# Altium project gydrodrive_control_board.PrjPcb (part 2 of 2)

## Sheet gydrodrive_currentSource.SchDoc
size 297 x 209 mm; SheetNumber: 8; SheetTotal: 22
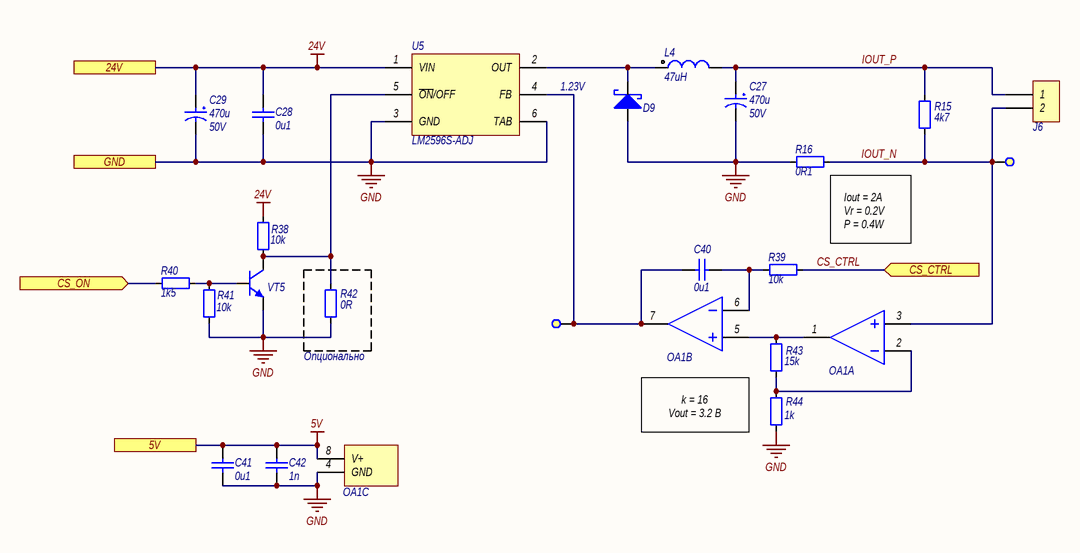
[diagram p11: gydrodrive_currentSource.SchDoc]

### Parts
C27  Capacitance: 470u  Voltage: 50V  [ECAP1020]  (hidden comment: JRB1H471M05001000200000B)
C28  Capacitance: 0u1  [CAPC2012-0805M]  (hidden comment: CAP_0805)
C29  Capacitance: 470u  Voltage: 50V  [ECAP1020]  (hidden comment: JRB1H471M05001000200000B)
C40  Capacitance: 0u1  [CAPC2012-0805M]  (hidden comment: CAP_0805)
C41  Capacitance: 0u1  [CAPC2012-0805M]  (hidden comment: CAP_0805)
C42  Capacitance: 1n  [CAPC2012-0805M]  (hidden comment: CAP_0805)
D9  SK56  [SMB_M]  (value not drawn)
J6  DG142V-5.08-02P  [DG142V-5.08-02P]  (value not drawn)
L4  Inductance: 47uH  [IND_IHL4040_M]  (hidden comment: IHLP4040DZER470M11)
OA1  LMV358IDR  [SO8_M]  (value not drawn)  (parts A,B,C of 3)
R15  Resistance: 4k7  [RESC3216-1206M]  (hidden comment: RES_1206)
R16  Resistance: 0R1  [RESC6332-2512M]  (hidden comment: RES_2512)
R38  Resistance: 10k  [RESC2012-0805M]  (hidden comment: RES_0805)
R39  Resistance: 10k  [RESC2012-0805M]  (hidden comment: RES_0805)
R40  Resistance: 1k5  [RESC2012-0805M]  (hidden comment: RES_0805)
R41  Resistance: 10k  [RESC2012-0805M]  (hidden comment: RES_0805)
R42  Resistance: 0R  [RESC2012-0805M]  (hidden comment: RES_0805)
R43  Resistance: 15k  [RESC2012-0805M]  (hidden comment: RES_0805)
R44  Resistance: 1k  [RESC2012-0805M]  (hidden comment: RES_0805)
TP6  Test point 1  [TP_1]  (value not drawn)  (no BOM)
TP7  Test point 1  [TP_1]  (value not drawn)  (no BOM)
U5  LM2596S-ADJ  [TO-263-5M]
VT5  BC817  [SOT23-3M]  (value not drawn)

### Ports
5V (see gydrodrive_main[1B], gydrodrive_can[4B], gydrodrive_discreteControl[3B], gydrodrive_interfaces[3C], gydrodrive_supply[5A]), 24V (see gydrodrive_main[1B], gydrodrive_button[4B], gydrodrive_control[4B], gydrodrive_discreteControl[4B], gydrodrive_encoder[5B], gydrodrive_linearPosSensor[3B], gydrodrive_sensor[3B], gydrodrive_sensors[2B], gydrodrive_sto[4B], gydrodrive_supply[2B]), CS_CTRL (in, see gydrodrive_main[2B], gydrodrive_mcu[3A]), CS_ON (in, see gydrodrive_main[2B], gydrodrive_mcu[3C]), GND (see gydrodrive_main[1B], gydrodrive_button[3C], gydrodrive_can[3C], gydrodrive_control[3B], gydrodrive_debugger[4C], gydrodrive_discreteControl[3B], gydrodrive_encoder[2A], gydrodrive_i2c[5C], gydrodrive_indication[4C], gydrodrive_inputTrim[4C], gydrodrive_interfaces[3A], gydrodrive_linearPosSensor[2C], gydrodrive_mcu[6D], gydrodrive_reservedPins[4B], gydrodrive_rs485[3B], gydrodrive_sensor[3C], gydrodrive_sensors[2B], gydrodrive_sto[3C], gydrodrive_supply[2C], gydrodrive_uart[4C])

### Nets
5V: C41.2 C42.2 OA1.8(V+) ; port 5V
24V: C28.1 C29.1 R38.2 U5.1(VIN) ; port 24V
GND: C27.2 C28.2 C29.2 C41.1 C42.1 D9.2(A) OA1.4(GND) R16.1 R41.1 R42.1 R44.1 U5.3(GND) U5.6(TAB) VT5.2(E) ; port GND
CS_CTRL: R39.1 ; port CS_CTRL
CS_ON: R40.2 ; port CS_ON
IOUT_N: J6.2 OA1.3(INA+) R15.1 R16.2 TP6.1
IOUT_P: C27.1 J6.1 L4.2 R15.2
NetC40_1: C40.1 OA1.6(INB-) R39.2
NetC40_2: C40.2 OA1.7(OUTB) TP7.1 U5.4(FB)
NetD9_1: D9.1(K) L4.1 U5.2(OUT)
NetOA1_1: OA1.1(OUTA) OA1.5(INB+) R43.2
NetOA1_2: OA1.2(INA-) R43.1 R44.2
NetR38_1: R38.1 R42.2 U5.5(~{ON}/OFF) VT5.3(C)
NetR40_1: R40.1 R41.2 VT5.1(B)

### Notes on the sheet
- 1.23V
- (near R16) Iout = 2A
  Vr = 0.2V
  P = 0.4W
- (near R42) Опционально
- k = 16
  Vout = 3.2 В
- Подп. и дата
- Инв. № дубл.
- Взам. инв. №
- Инв. № подл.
- Изм.
- Лист
- № докум.
- Подп.
- Дата
- Копировал
- Формат
- A4

### Library data of the parts
C27 C29 = JRB1H471M05001000200000B: Конденсатор электролитический; Part Name: Конд-р электрол.  JRB1H471M05001000200000B, 470uF, 50V; Parameters: 470uF, 50V; Max Price: 30; Part Number: JRB1H471M05001000200000B; Component Type: Standart
C28 C40 C41 = CAPC_0805: as C1 on sheet gydrodrive_mcu; Part Number: CAPC_0805; Part Name: ='Конд-р керам. 0805,  '  + Parameters; Component Type: Standart; Pin Count: 2
C42 = CAPC_0805: Конденсатор керамический, корпус 0805; Parameters: 1n,  50V; Voltage: 50V; Max Price: 5; Part Number: CAPC_0805; Part Name: ='Конд-р керам. 0805,  '  + Parameters; Component Type: Standart; Pin Count: 2
D9 = SK56: Диод Шоттки; Part Name: Диод Шоттки SK56; Parameters: 60V, 5A; Voltage: 60V; Current: 5A; Max Price: 50; Part Number: SK56; Component Type: Standart; Pin Count: 2
J6 = DG142V-5.08-02P: as J1 on sheet gydrodrive_supply; Part Number: DG142V-5.08-02P; Component Type: Standart; Pin Count: 2
L4 = IHLP4040DZER470M11: Индуктивность силовая; Part Name: Индуктивность IHLP4040DZER470M11; Current: 3A; Max Price: 100; Part Number: IHLP4040DZER470M11; Component Type: Standart; Pin Count: 2; Parameters: 47uH
OA1 = LMV358IDR: Операционный усилитель RTR, маломощный, 2 канала; Part Name: Операционный усилитель LMV358IDR; Supply Current: 210uA; Supply Voltage: 2.7..5.5V; Max Price: 40; Offset Voltage: 1700uV; Bias Current: 15nA; RTR: IO; Part Number: LMV358IDR; Component Type: Standart; Pin Count: 8
R15 = RESC_1206: Рез-р, корпус 1206; Tolerance: 5%; Parameters: 4k7, 5%; Max Price: 12; Part Number: RESC_1206; Part Name: ='Рез-р 1206, ' + Parameters; Component Type: Standart
R16 = RESC_2512: Рез-р, корпус 2512; Tolerance: 5%; Parameters: 0R1, 5%; Max Price: 20; Part Number: RESC_2512; Part Name: ='Рез-р 2512, ' + Parameters; Component Type: Standart
R38 R39 R41 = RESC_0805: as R45 on sheet gydrodrive_mcu; Part Number: RESC_0805; Part Name: ='Рез-р 0805, ' + Parameters; Component Type: Standart
R40 = RESC_0805: Рез-р, корпус 0805; Tolerance: 5%; Parameters: 1k5, 5%; Max Price: 3; Part Number: RESC_0805; Part Name: ='Рез-р 0805, ' + Parameters; Component Type: Standart
R42 = RESC_0805: Рез-р, корпус 0805; Tolerance: 5%; Parameters: 0R, 5%; Max Price: 3; Part Number: RESC_0805; Part Name: ='Рез-р 0805, ' + Parameters; Component Type: Standart
R43 = RESC_0805: Рез-р, корпус 0805; Tolerance: 5%; Parameters: 15k, 5%; Max Price: 3; Part Number: RESC_0805; Part Name: ='Рез-р 0805, ' + Parameters; Component Type: Standart
R44 = RESC_0805: Рез-р, корпус 0805; Tolerance: 5%; Parameters: 1k, 5%; Max Price: 3; Part Number: RESC_0805; Part Name: ='Рез-р 0805, ' + Parameters; Component Type: Standart
TP6 TP7 = Test point 1: Тестовый контакт круглый 1 мм; Part Number: Test point 1; Part Name: Тестовый контакт; Component Type: Standart (No BOM)
U5 = LM2596S-ADJ: DC-DC преобразователь; Part Name: DC-DC преобразователь LM2596S-ADJ; Parameters: 40V, 1.23..37V, 3A, 150kHz; Max Price: 600; ComponentLink1Description: LM2596 Datasheet; ComponentLink1URL: http://www.national.com/ds/LM/LM2596.pdf; ComponentLink3Description: TS5B Package Page; ComponentLink3URL: http://www.national.com/packaging/folders/ts5b.html; Part Number: LM2596S-ADJ; Component Type: Standart; HelpURL: https://www.ti.com/lit/ds/symlink/lm2596.pdf
VT5 = BC817: Биполярный транзистор; Part Name: Транзистор BC817; Parameters: 45V, 0.5A; Voltage: 45V; Current: 500 mA; Max Price: 20; Part Number: BC817; Component Type: Standart

## Sheet gydrodrive_interfaces.SchDoc
size 297 x 209 mm; SheetNumber: 13; SheetTotal: 22
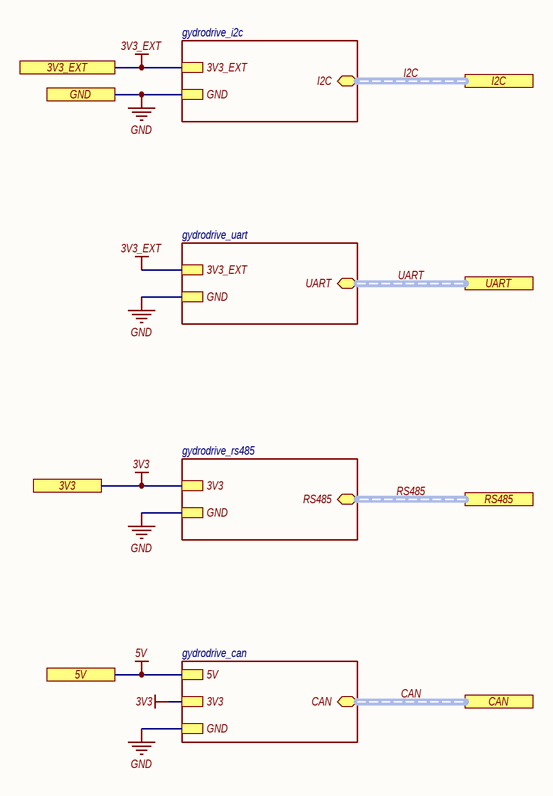
[diagram p12: gydrodrive_interfaces.SchDoc]

### Sub-sheets
C = gydrodrive_can: CAN (bidir, harness CAN), GND, 5V, 3V3
I = gydrodrive_i2c: I2C (bidir, harness I2C), 3V3_EXT, GND
R = gydrodrive_rs485: RS485 (bidir, harness RS485), GND, 3V3
U = gydrodrive_uart: UART (bidir, harness UART), GND, 3V3_EXT

### Ports
3V3 (see gydrodrive_main[1A], gydrodrive_button[3B], gydrodrive_can[3B], gydrodrive_debugger[3B], gydrodrive_encoder[2A], gydrodrive_indication[4C], gydrodrive_inputTrim[4B], gydrodrive_mcu[4C], gydrodrive_rs485[4B], gydrodrive_sto[3B], gydrodrive_supply[5B]), 3V3_EXT (see gydrodrive_main[1A], gydrodrive_i2c[5B], gydrodrive_reservedPins[4B], gydrodrive_supply[5B], gydrodrive_uart[4B]), 5V (see gydrodrive_main[1A], gydrodrive_can[4B], gydrodrive_currentSource[2C], gydrodrive_discreteControl[3B], gydrodrive_supply[5A]), CAN (harness CAN, see gydrodrive_main[2A], gydrodrive_can[1C], gydrodrive_mcu[1C]), GND (see gydrodrive_main[1A], gydrodrive_button[3C], gydrodrive_can[3C], gydrodrive_control[3B], gydrodrive_currentSource[2B], gydrodrive_debugger[4C], gydrodrive_discreteControl[3B], gydrodrive_encoder[2A], gydrodrive_i2c[5C], gydrodrive_indication[4C], gydrodrive_inputTrim[4C], gydrodrive_linearPosSensor[2C], gydrodrive_mcu[6D], gydrodrive_reservedPins[4B], gydrodrive_rs485[3B], gydrodrive_sensor[3C], gydrodrive_sensors[2B], gydrodrive_sto[3C], gydrodrive_supply[2C], gydrodrive_uart[4C]), I2C (harness I2C, see gydrodrive_main[2A], gydrodrive_i2c[1C], gydrodrive_mcu[1B]), RS485 (harness RS485, see gydrodrive_main[2A], gydrodrive_mcu[1C], gydrodrive_rs485[1B]), UART (harness UART, see gydrodrive_main[2A], gydrodrive_mcu[1B], gydrodrive_uart[3B])

### Nets
3V3: port 3V3, sheet R/3V3, sheet C/3V3
3V3_EXT: port 3V3_EXT, sheet I/3V3_EXT, sheet U/3V3_EXT
5V: port 5V, sheet C/5V
GND: port GND, sheet I/GND, sheet U/GND, sheet R/GND, sheet C/GND

### Buses and harness runs
harness CAN = port CAN = sheet C/CAN
harness I2C = port I2C = sheet I/I2C
harness RS485 = port RS485 = sheet R/RS485
harness UART = port UART = sheet U/UART

### Notes on the sheet
- Подп. и дата
- Инв. № дубл.
- Взам. инв. №
- Инв. № подл.
- Изм.
- Лист
- № докум.
- Подп.
- Дата
- Копировал
- Формат
- A4

## Sheet gydrodrive_i2c.SchDoc
size 297 x 209 mm; SheetNumber: 17; SheetTotal: 22
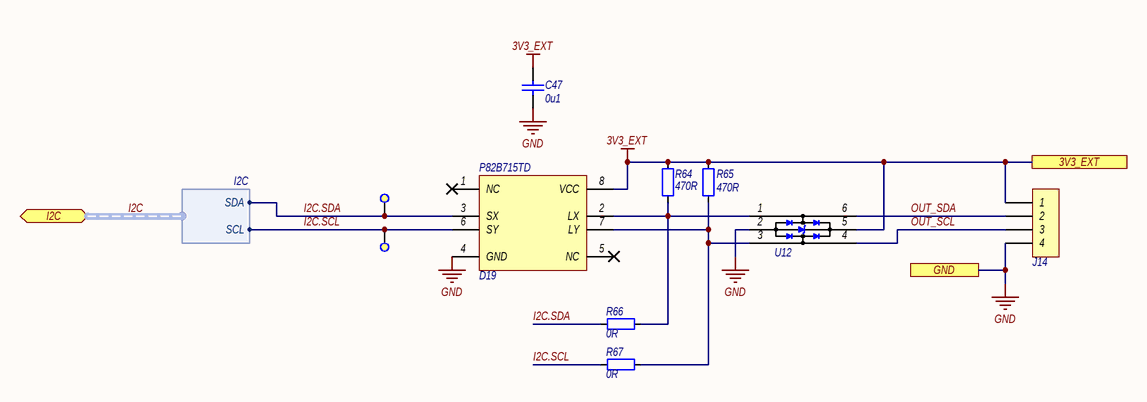
[diagram p13: gydrodrive_i2c.SchDoc]

### Parts
C47  Capacitance: 0u1  [CAPC2012-0805M]  (hidden comment: CAP_0805)
D19  P82B715TD  [SO8_M]
J14  DG142V-5.08-04P  [DG142V-5.08-04P]  (value not drawn)
R64  Resistance: 470R  [RESC2012-0805M]  (hidden comment: RES_0805)
R65  Resistance: 470R  [RESC2012-0805M]  (hidden comment: RES_0805)
R66  Resistance: 0R  [RESC2012-0805M]  (hidden comment: RES_0805)
R67  Resistance: 0R  [RESC2012-0805M]  (hidden comment: RES_0805)
TP16  Test point 1  [TP_1]  (value not drawn)  (no BOM)
TP17  Test point 1  [TP_1]  (value not drawn)  (no BOM)
U12  USBLC6-2SC6  [SOT23-6AM]  (value not drawn)

### Ports
3V3_EXT (see gydrodrive_interfaces[3A], gydrodrive_reservedPins[2B], gydrodrive_supply[3B], gydrodrive_uart[2B]), GND (see gydrodrive_interfaces[3A], gydrodrive_button[2C], gydrodrive_can[2C], gydrodrive_control[2C], gydrodrive_currentSource[1B], gydrodrive_debugger[3C], gydrodrive_discreteControl[2B], gydrodrive_encoder[1B], gydrodrive_indication[3C], gydrodrive_inputTrim[2C], gydrodrive_interfaces[3A], gydrodrive_linearPosSensor[2C], gydrodrive_mcu[6D], gydrodrive_reservedPins[2C], gydrodrive_rs485[2B], gydrodrive_sensor[2C], gydrodrive_sensors[1B], gydrodrive_sto[2C], gydrodrive_supply[2C], gydrodrive_uart[2C]), I2C (bidir, harness I2C, see gydrodrive_interfaces[4A], gydrodrive_mcu[1B])

### Harnesses
I2C: SDA, SCL

### Nets
3V3_EXT: C47.1 D19.8(VCC) J14.1 R64.2 R65.2 U12.5(Vbus) ; port 3V3_EXT
GND: C47.2 D19.4(GND) J14.4 U12.2(GND) ; port GND
I2C.SCL: D19.6(SY) R67.1 TP17.1 ; port I2C.SCL
I2C.SDA: D19.3(SX) R66.1 TP16.1 ; port I2C.SDA
OUT_SCL: J14.3 U12.4(IO2)
OUT_SDA: J14.2 U12.6(IO1)
NetD19_2: D19.2(LX) R64.1 R66.2 U12.1(IO1)
NetD19_7: D19.7(LY) R65.1 R67.2 U12.3(IO2)

Not connected (* = marked no-connect by the designer): D19 1(NC)* 5(NC)*

### Buses and harness runs
harness I2C = port I2C

### Notes on the sheet
- Подп. и дата
- Инв. № дубл.
- Взам. инв. №
- Инв. № подл.
- Изм.
- Лист
- № докум.
- Подп.
- Дата
- Копировал
- Формат
- A4

### Library data of the parts
C47 = CAPC_0805: as C1 on sheet gydrodrive_mcu; Part Number: CAPC_0805; Part Name: ='Конд-р керам. 0805,  '  + Parameters; Component Type: Standart; Pin Count: 2
D19 = P82B715TD: Расширитель порта I2C; Part Name: Микросхема P82B715TD; Max Price: 300; Part Number: P82B715TD; Component Type: Standart; Parameters: I2C
J14 = DG142V-5.08-04P: Клеммник 4-контактный, шаг 5.08 мм; Part Name: Клеммник DG142V-5.08-04P; Parameters: 8А; Max Price: 60; System: Connector; Part Number: DG142V-5.08-04P; Component Type: Standart; Pin Count: 4
R64 R65 = RESC_0805: Рез-р, корпус 0805; Tolerance: 5%; Parameters: 470R, 5%; Max Price: 3; Part Number: RESC_0805; Part Name: ='Рез-р 0805, ' + Parameters; Component Type: Standart
R66 R67 = RESC_0805: as R42 on sheet gydrodrive_currentSource; Part Number: RESC_0805; Part Name: ='Рез-р 0805, ' + Parameters; Component Type: Standart
TP16 TP17 = Test point 1: Тестовый контакт круглый 1 мм; Part Number: Test point 1; Part Name: Тестовый контакт; Component Type: Standart (No BOM)
U12 = USBLC6-2SC6: Диодная сборка для защиты дифференциальной линии; Part Name: Диодная сборка USBLC6-2SC6; Parameters: 5.25V; Max Price: 30; Part Number: USBLC6-2SC6; Component Type: Standart; Pin Count: 6; Voltage: 5.25V

## Sheet gydrodrive_uart.SchDoc
size 297 x 209 mm; SheetNumber: 15; SheetTotal: 22
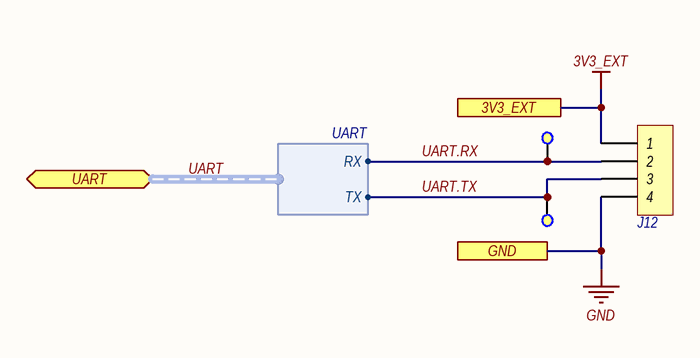
[diagram p14: gydrodrive_uart.SchDoc]

### Parts
J12  DG142V-5.08-04P  [DG142V-5.08-04P]  (value not drawn)
TP12  Test point 1  [TP_1]  (value not drawn)  (no BOM)
TP13  Test point 1  [TP_1]  (value not drawn)  (no BOM)

### Ports
3V3_EXT (see gydrodrive_interfaces[3B], gydrodrive_i2c[5B], gydrodrive_interfaces[3A], gydrodrive_reservedPins[2B], gydrodrive_supply[3B]), GND (see gydrodrive_interfaces[3B], gydrodrive_button[2C], gydrodrive_can[2C], gydrodrive_control[2C], gydrodrive_currentSource[1B], gydrodrive_debugger[3C], gydrodrive_discreteControl[2B], gydrodrive_encoder[1B], gydrodrive_i2c[5C], gydrodrive_indication[3C], gydrodrive_inputTrim[2C], gydrodrive_interfaces[3A], gydrodrive_linearPosSensor[2C], gydrodrive_mcu[6D], gydrodrive_reservedPins[2C], gydrodrive_rs485[2B], gydrodrive_sensor[2C], gydrodrive_sensors[1B], gydrodrive_sto[2C], gydrodrive_supply[2C]), UART (bidir, harness UART, see gydrodrive_interfaces[4B], gydrodrive_mcu[1B])

### Harnesses
UART: RX, TX

### Nets
3V3_EXT: J12.1 ; port 3V3_EXT
GND: J12.4 ; port GND
UART.RX: J12.2 TP12.1 ; port UART.RX
UART.TX: J12.3 TP13.1 ; port UART.TX

### Buses and harness runs
harness UART = port UART

### Notes on the sheet
- Подп. и дата
- Инв. № дубл.
- Взам. инв. №
- Инв. № подл.
- Изм.
- Лист
- № докум.
- Подп.
- Дата
- Копировал
- Формат
- A4

### Library data of the parts
J12 = DG142V-5.08-04P: as J14 on sheet gydrodrive_i2c; Part Number: DG142V-5.08-04P; Component Type: Standart; Pin Count: 4
TP12 TP13 = Test point 1: Тестовый контакт круглый 1 мм; Part Number: Test point 1; Part Name: Тестовый контакт; Component Type: Standart (No BOM)

## Sheet gydrodrive_rs485.SchDoc
size 297 x 209 mm; SheetNumber: 14; SheetTotal: 22
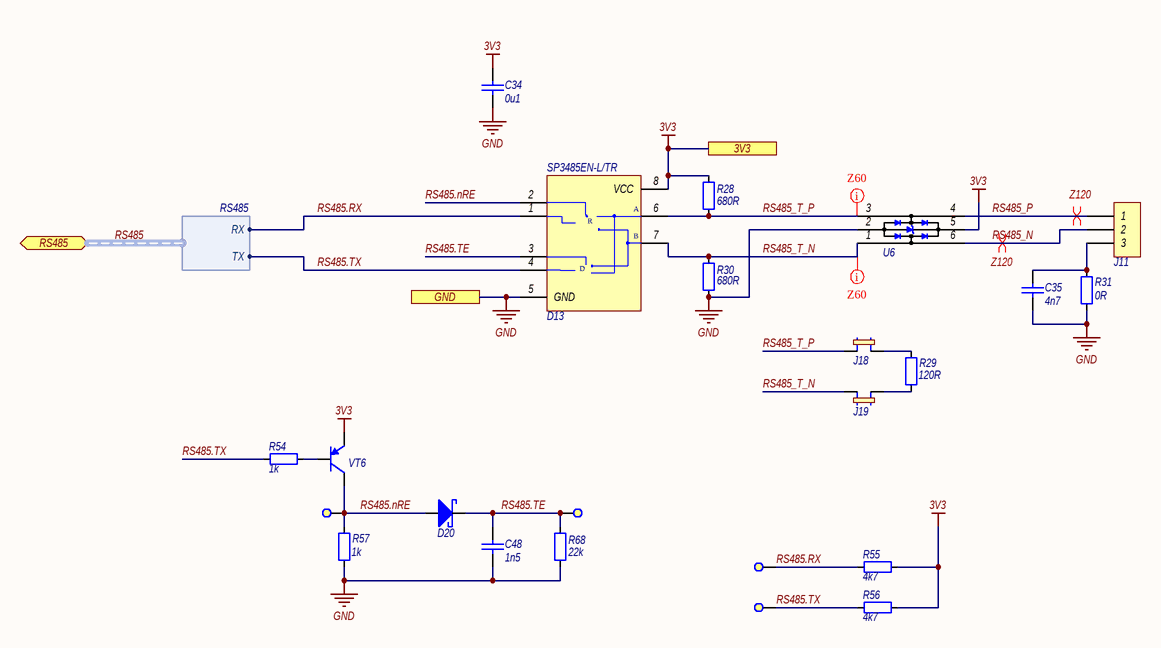
[diagram p15: gydrodrive_rs485.SchDoc]

### Parts
C34  Capacitance: 0u1  [CAPC2012-0805M]  (hidden comment: CAP_0805)
C35  Capacitance: 4n7  [CAPC3216-1206M]  (hidden comment: CAP_1206)
C48  Capacitance: 1n5  [CAPC2012-0805M]  (hidden comment: CAP_0805)
D13  SP3485EN-L/TR  [SO8_M]
D20  MBR0540  [SOD_123_M]  (value not drawn)
J11  DG142V-5.08-03P  [DG142V-5.08-03P]  (value not drawn)
J18  PLS-2.54-2 JUMP  [PLS-2-2.54]  (value not drawn)
J19  PLS-2.54-2 JUMP  [PLS-2-2.54]  (value not drawn)
R28  Resistance: 680R  [RESC3216-1206M]  (hidden comment: RES_1206)
R29  Resistance: 120R  [RESC3216-1206M]  (hidden comment: RES_1206)
R30  Resistance: 680R  [RESC3216-1206M]  (hidden comment: RES_1206)
R31  Resistance: 0R  [RESC3216-1206M]  (hidden comment: RES_1206)
R54  Resistance: 1k  [RESC2012-0805M]  (hidden comment: RES_0805)
R55  Resistance: 4k7  [RESC2012-0805M]  (hidden comment: RES_0805)
R56  Resistance: 4k7  [RESC2012-0805M]  (hidden comment: RES_0805)
R57  Resistance: 1k  [RESC2012-0805M]  (hidden comment: RES_0805)
R68  Resistance: 22k  [RESC2012-0805M]  (hidden comment: RES_0805)
TP1  Test point 1  [TP_1]  (value not drawn)  (no BOM)
TP10  Test point 1  [TP_1]  (value not drawn)  (no BOM)
TP11  Test point 1  [TP_1]  (value not drawn)  (no BOM)
TP19  Test point 1  [TP_1]  (value not drawn)  (no BOM)
U6  USBLC6-2SC6  [SOT23-6AM]  (value not drawn)
VT6  BC807  [SOT23-3M]  (value not drawn)

### Ports
3V3 (see gydrodrive_interfaces[3C], gydrodrive_button[2B], gydrodrive_can[2B], gydrodrive_debugger[2B], gydrodrive_encoder[1A], gydrodrive_indication[3C], gydrodrive_inputTrim[2B], gydrodrive_interfaces[3C], gydrodrive_mcu[4C], gydrodrive_sto[2B], gydrodrive_supply[3C]), GND (see gydrodrive_interfaces[3C], gydrodrive_button[2C], gydrodrive_can[2C], gydrodrive_control[2C], gydrodrive_currentSource[1B], gydrodrive_debugger[3C], gydrodrive_discreteControl[2B], gydrodrive_encoder[1B], gydrodrive_i2c[5C], gydrodrive_indication[3C], gydrodrive_inputTrim[2C], gydrodrive_interfaces[3A], gydrodrive_linearPosSensor[2C], gydrodrive_mcu[6D], gydrodrive_reservedPins[2C], gydrodrive_sensor[2C], gydrodrive_sensors[1B], gydrodrive_sto[2C], gydrodrive_supply[2C], gydrodrive_uart[4C]), RS485 (bidir, harness RS485, see gydrodrive_interfaces[4C], gydrodrive_mcu[1C])

### Harnesses
RS485: RX, TX

### Nets
3V3: C34.2 D13.8(VCC) R28.2 R55.1 R56.1 U6.5(Vbus) VT6.2(E) ; port 3V3
GND: C34.1 C35.1 C48.1 D13.5(GND) R30.1 R31.2 R57.1 R68.1 U6.2(GND) ; port GND
RS485.nRE: D13.2(~{RE}) D20.2(A) R57.2 TP19.1 VT6.3(C)
RS485.RX: D13.1(RO) R55.2 TP10.1 ; port RS485.RX
RS485.TE: C48.2 D13.3(DE) D20.1(K) R68.2 TP11.1
RS485.TX: D13.4(DI) R54.2 R56.2 TP1.1 ; port RS485.TX
RS485_N: J11.2 U6.6(IO1)
RS485_P: J11.1 U6.4(IO2)
RS485_T_N: D13.7(B) J19.2 R30.2 U6.1(IO1)
RS485_T_P: D13.6(A) J18.2 R28.1 U6.3(IO2)
NetC35_2: C35.2 J11.3 R31.1
NetJ18_1: J18.1 R29.2
NetJ19_1: J19.1 R29.1
NetR54_1: R54.1 VT6.1(B)

### Buses and harness runs
harness RS485 = port RS485

### Layout directives
differential pair; differential pair class Z120: RS485_N, RS485_P
net class Z60: RS485_T_N, RS485_T_P

### Notes on the sheet
- Подп. и дата
- Инв. № дубл.
- Взам. инв. №
- Инв. № подл.
- Изм.
- Лист
- № докум.
- Подп.
- Дата
- Копировал
- Формат
- A4
- (in symbol SP3485EN-L/TR) R; D

### Library data of the parts
C34 = CAPC_0805: Конденсатор керамический, корпус 0805; Parameters: 0u1,  50V; Voltage: 50V; Max Price: 5; Part Number: CAPC_0805; Part Name: ='Конд-р керам. 0805,  '  + Parameters; Component Type: Standart; Pin Count: 2
C35 = CAPC_1206: Конденсатор керамический, корпус 1206; Parameters: 4n7,  50V; Voltage: 50V; Max Price: 12; Part Number: CAPC_1206; Part Name: ='Конд-р керам. 1206,  '  + Parameters; Component Type: Standart; Pin Count: 2
C48 = CAPC_0805: Конденсатор керамический, корпус 0805; Parameters: 1n5,  50V; Voltage: 50V; Max Price: 5; Part Number: CAPC_0805; Part Name: ='Конд-р керам. 0805,  '  + Parameters; Component Type: Standart; Pin Count: 2
D13 = SP3485EN-L/TR: Дифференциальный приемопередатчик rs485; Part Name: Микросхема SP3485EN-L/TR; Parameters: 3V3; Max Price: 50; Part Number: SP3485EN-L/TR; Component Type: Standart
D20 = MBR0540: Диод Шоттки; Part Name: Диод Шоттки MBR0540; Parameters: 40V, 0.5A; Voltage: 40V; Current: 500mA; Max Price: 10; Part Number: MBR0540; Component Type: Standart; Pin Count: 2
J11 = DG142V-5.08-03P: Клеммник 3-контактный, шаг 5.08 мм; Part Name: Клеммник DG142V-5.08-03P; Parameters: 8А; Max Price: 60; System: Connector; Part Number: DG142V-5.08-03P; Component Type: Standart; Pin Count: 3
J18 J19 = PLS-2.54-2 JUMP: Разъем штыревой шаг 2.54 мм; Part Name: Разъем PLS-2, шаг 2.54 мм; Parameters: 2.54 мм; Max Price: 10; System: Connector; Part Number: PLS-2.54-2 JUMP; Component Type: Standart; Pin Count: 2
R28 R30 = RESC_1206: Рез-р, корпус 1206; Tolerance: 5%; Parameters: 680R, 5%; Max Price: 12; Part Number: RESC_1206; Part Name: ='Рез-р 1206, ' + Parameters; Component Type: Standart
R29 = RESC_1206: Рез-р, корпус 1206; Tolerance: 5%; Parameters: 120R, 5%; Max Price: 12; Part Number: RESC_1206; Part Name: ='Рез-р 1206, ' + Parameters; Component Type: Standart
R31 = RESC_1206: Рез-р, корпус 1206; Tolerance: 5%; Parameters: 0R, 5%; Max Price: 12; Part Number: RESC_1206; Part Name: ='Рез-р 1206, ' + Parameters; Component Type: Standart
R54 R57 = RESC_0805: Рез-р, корпус 0805; Tolerance: 5%; Parameters: 1k, 5%; Max Price: 3; Part Number: RESC_0805; Part Name: ='Рез-р 0805, ' + Parameters; Component Type: Standart
R55 R56 = RESC_0805: Рез-р, корпус 0805; Tolerance: 5%; Parameters: 4k7, 5%; Max Price: 3; Part Number: RESC_0805; Part Name: ='Рез-р 0805, ' + Parameters; Component Type: Standart
R68 = RESC_0805: Рез-р, корпус 0805; Tolerance: 5%; Parameters: 22k, 5%; Max Price: 3; Part Number: RESC_0805; Part Name: ='Рез-р 0805, ' + Parameters; Component Type: Standart
TP1 TP10 TP11 TP19 = Test point 1: Тестовый контакт круглый 1 мм; Part Number: Test point 1; Part Name: Тестовый контакт; Component Type: Standart (No BOM)
U6 = USBLC6-2SC6: Диодная сборка для защиты дифференциальной линии; Part Name: Диодная сборка USBLC6-2SC6; Parameters: 5.25V; Max Price: 30; Part Number: USBLC6-2SC6; Component Type: Standart; Pin Count: 6; Voltage: 5.25V
VT6 = BC807: Биполярный транзистор; Part Name: Транзистор BC807; Parameters: 45V, 0.5A; Voltage: 45V; Current: 500 mA; Max Price: 20; Part Number: BC807; Component Type: Standart

## Sheet gydrodrive_can.SchDoc
size 297 x 209 mm; SheetNumber: 16; SheetTotal: 22
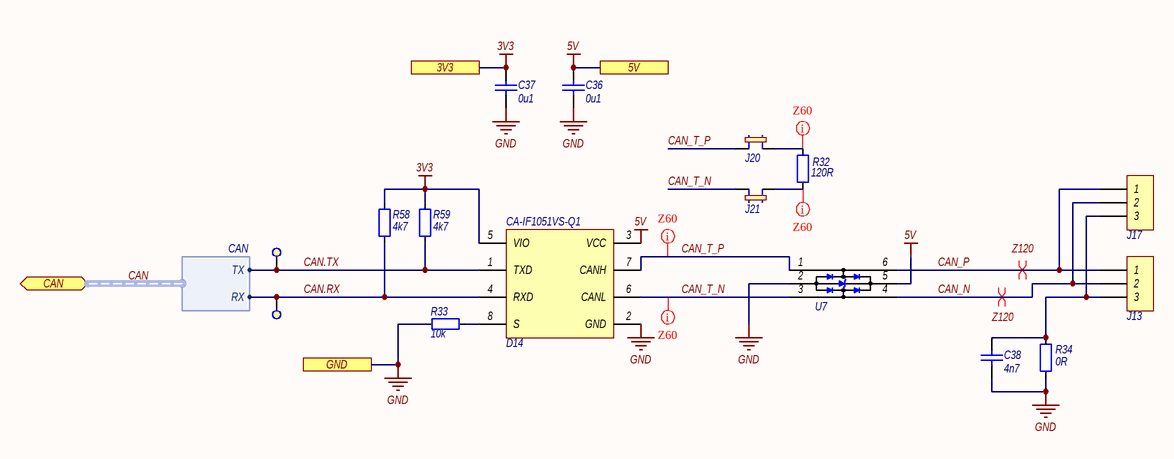
[diagram p16: gydrodrive_can.SchDoc]

### Parts
C36  Capacitance: 0u1  [CAPC2012-0805M]  (hidden comment: CAP_0805)
C37  Capacitance: 0u1  [CAPC2012-0805M]  (hidden comment: CAP_0805)
C38  Capacitance: 4n7  [CAPC3216-1206M]  (hidden comment: CAP_1206)
D14  CA-IF1051VS-Q1  [SO8_N]
J13  DG142V-5.08-03P  [DG142V-5.08-03P]  (value not drawn)
J17  DG142V-5.08-03P  [DG142V-5.08-03P]  (value not drawn)
J20  PLS-2.54-2 JUMP  [PLS-2-2.54]  (value not drawn)
J21  PLS-2.54-2 JUMP  [PLS-2-2.54]  (value not drawn)
R32  Resistance: 120R  [RESC3216-1206M]  (hidden comment: RES_1206)
R33  Resistance: 10k  [RESC2012-0805M]  (hidden comment: RES_0805)
R34  Resistance: 0R  [RESC3216-1206M]  (hidden comment: RES_1206)
R58  Resistance: 4k7  [RESC2012-0805M]  (hidden comment: RES_0805)
R59  Resistance: 4k7  [RESC2012-0805M]  (hidden comment: RES_0805)
TP14  Test point 1  [TP_1]  (value not drawn)  (no BOM)
TP15  Test point 1  [TP_1]  (value not drawn)  (no BOM)
U7  USBLC6-2SC6  [SOT23-6AM]  (value not drawn)

### Ports
3V3 (see gydrodrive_interfaces[3C], gydrodrive_button[2B], gydrodrive_debugger[2B], gydrodrive_encoder[1A], gydrodrive_indication[3C], gydrodrive_inputTrim[2B], gydrodrive_interfaces[3C], gydrodrive_mcu[4C], gydrodrive_rs485[4B], gydrodrive_sto[2B], gydrodrive_supply[3C]), 5V (see gydrodrive_interfaces[3C], gydrodrive_currentSource[1C], gydrodrive_discreteControl[2B], gydrodrive_interfaces[3C], gydrodrive_supply[3B]), CAN (bidir, harness CAN, see gydrodrive_interfaces[4C], gydrodrive_mcu[1C]), GND (see gydrodrive_interfaces[3D], gydrodrive_button[2C], gydrodrive_control[2C], gydrodrive_currentSource[1B], gydrodrive_debugger[3C], gydrodrive_discreteControl[2B], gydrodrive_encoder[1B], gydrodrive_i2c[5C], gydrodrive_indication[3C], gydrodrive_inputTrim[2C], gydrodrive_interfaces[3A], gydrodrive_linearPosSensor[2C], gydrodrive_mcu[6D], gydrodrive_reservedPins[2C], gydrodrive_rs485[3B], gydrodrive_sensor[2C], gydrodrive_sensors[1B], gydrodrive_sto[2C], gydrodrive_supply[2C], gydrodrive_uart[4C])

### Harnesses
CAN: TX, RX

### Nets
3V3: C37.2 D14.5(VIO) R58.2 R59.2 ; port 3V3
5V: C36.2 D14.3(VCC) U7.5(Vbus) ; port 5V
GND: C36.1 C37.1 C38.1 D14.2(GND) R33.1 R34.2 U7.2(GND) ; port GND
CAN.RX: D14.4(RXD) R58.1 TP15.1 ; port CAN.RX
CAN.TX: D14.1(TXD) R59.1 TP14.1 ; port CAN.TX
CAN_N: J13.2 J17.2 U7.4(IO2)
CAN_P: J13.1 J17.1 U7.6(IO1)
CAN_T_N: D14.6(CANL) J21.2 U7.3(IO2)
CAN_T_P: D14.7(CANH) J20.2 U7.1(IO1)
NetC38_2: C38.2 J13.3 J17.3 R34.1
NetD14_8: D14.8(S) R33.2
NetJ20_1: J20.1 R32.2
NetJ21_1: J21.1 R32.1

### Buses and harness runs
harness CAN = port CAN

### Layout directives
differential pair; differential pair class Z120: CAN_N, CAN_P
net class Z60: CAN_T_N, CAN_T_P, NetJ20_1, NetJ21_1

### Notes on the sheet
- Подп. и дата
- Инв. № дубл.
- Взам. инв. №
- Инв. № подл.
- Изм.
- Лист
- № докум.
- Подп.
- Дата
- Копировал
- Формат
- A4

### Library data of the parts
C36 C37 = CAPC_0805: as C34 on sheet gydrodrive_rs485; Part Number: CAPC_0805; Part Name: ='Конд-р керам. 0805,  '  + Parameters; Component Type: Standart; Pin Count: 2
C38 = CAPC_1206: as C35 on sheet gydrodrive_rs485; Part Number: CAPC_1206; Part Name: ='Конд-р керам. 1206,  '  + Parameters; Component Type: Standart; Pin Count: 2
D14 = CA-IF1051VS-Q1: CAN интерфейс; Part Name: Микросхема CA-IF1051VS-Q1; Max Price: 50; Part Number: CA-IF1051VS-Q1; Component Type: Standart; Parameters: CAN
J13 J17 = DG142V-5.08-03P: as J11 on sheet gydrodrive_rs485; Part Number: DG142V-5.08-03P; Component Type: Standart; Pin Count: 3
J20 J21 = PLS-2.54-2 JUMP: as J18 on sheet gydrodrive_rs485; Part Number: PLS-2.54-2 JUMP; Component Type: Standart; Pin Count: 2
R32 = RESC_1206: as R29 on sheet gydrodrive_rs485; Part Number: RESC_1206; Part Name: ='Рез-р 1206, ' + Parameters; Component Type: Standart
R33 = RESC_0805: Рез-р, корпус 0805; Tolerance: 5%; Parameters: 10k, 5%; Max Price: 3; Part Number: RESC_0805; Part Name: ='Рез-р 0805, ' + Parameters; Component Type: Standart
R34 = RESC_1206: as R31 on sheet gydrodrive_rs485; Part Number: RESC_1206; Part Name: ='Рез-р 1206, ' + Parameters; Component Type: Standart
R58 R59 = RESC_0805: as R55 on sheet gydrodrive_rs485; Part Number: RESC_0805; Part Name: ='Рез-р 0805, ' + Parameters; Component Type: Standart
TP14 TP15 = Test point 1: Тестовый контакт круглый 1 мм; Part Number: Test point 1; Part Name: Тестовый контакт; Component Type: Standart (No BOM)
U7 = USBLC6-2SC6: as U6 on sheet gydrodrive_rs485; Part Number: USBLC6-2SC6; Component Type: Standart; Pin Count: 6; Voltage: 5.25V

## Sheet gydrodrive_sensors.SchDoc
size 297 x 209 mm; SheetNumber: 18; SheetTotal: 22
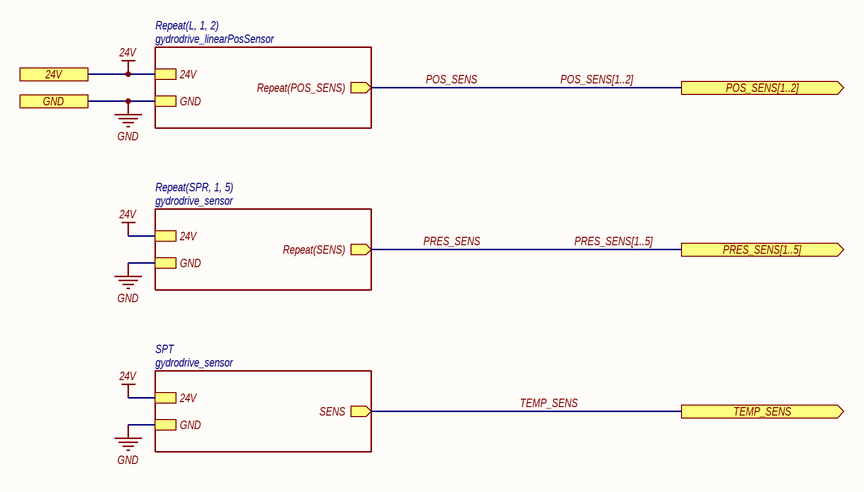
[diagram p17: gydrodrive_sensors.SchDoc]

### Sub-sheets
Repeat(L, 1, 2) = gydrodrive_linearPosSensor: 24V, GND, Repeat(POS_SENS) (out)
Repeat(SPR, 1, 5) = gydrodrive_sensor: Repeat(SENS) (out), 24V, GND
SPT = gydrodrive_sensor: SENS (out), 24V, GND

### Ports
24V (see gydrodrive_main[1B], gydrodrive_button[4B], gydrodrive_control[4B], gydrodrive_currentSource[2B], gydrodrive_discreteControl[4B], gydrodrive_encoder[5B], gydrodrive_linearPosSensor[3B], gydrodrive_sensor[3B], gydrodrive_sto[4B], gydrodrive_supply[2B]), GND (see gydrodrive_main[1B], gydrodrive_button[3C], gydrodrive_can[3C], gydrodrive_control[3B], gydrodrive_currentSource[2B], gydrodrive_debugger[4C], gydrodrive_discreteControl[3B], gydrodrive_encoder[2A], gydrodrive_i2c[5C], gydrodrive_indication[4C], gydrodrive_inputTrim[4C], gydrodrive_interfaces[3A], gydrodrive_linearPosSensor[2C], gydrodrive_mcu[6D], gydrodrive_reservedPins[4B], gydrodrive_rs485[3B], gydrodrive_sensor[3C], gydrodrive_sto[3C], gydrodrive_supply[2C], gydrodrive_uart[4C]), POS_SENS[1..2] (out, see gydrodrive_main[2B], gydrodrive_mcu[1A]), PRES_SENS[1..5] (out, see gydrodrive_main[2B], gydrodrive_mcu[1B]), TEMP_SENS (out, see gydrodrive_main[2B], gydrodrive_mcu[6A])

### Nets
24V: port 24V, sheet Repeat(SPR, 1, 5)/24V, sheet Repeat(L, 1, 2)/24V, sheet SPT/24V
GND: port GND, sheet Repeat(SPR, 1, 5)/GND, sheet Repeat(L, 1, 2)/GND, sheet SPT/GND
POS_SENS: sheet Repeat(L, 1, 2)/Repeat(POS_SENS)
PRES_SENS: sheet Repeat(SPR, 1, 5)/Repeat(SENS)
TEMP_SENS: port TEMP_SENS, sheet SPT/SENS

### Buses and harness runs
bus POS_SENS[1..2] = port POS_SENS[1..2]
bus PRES_SENS[1..5] = port PRES_SENS[1..5]

### Notes on the sheet
- Подп. и дата
- Инв. № дубл.
- Взам. инв. №
- Инв. № подл.
- Изм.
- Лист
- № докум.
- Подп.
- Дата
- Копировал
- Формат
- A4

## Sheet gydrodrive_sensor.SchDoc
size 297 x 209 mm; SheetNumber: 19; SheetTotal: 22
Used 6 times, as channels S/SPR1, S/SPR2, S/SPR3, S/SPR4, S/SPR5, S/SPT. Parts and nets are listed once, with the designators drawn on the sheet.
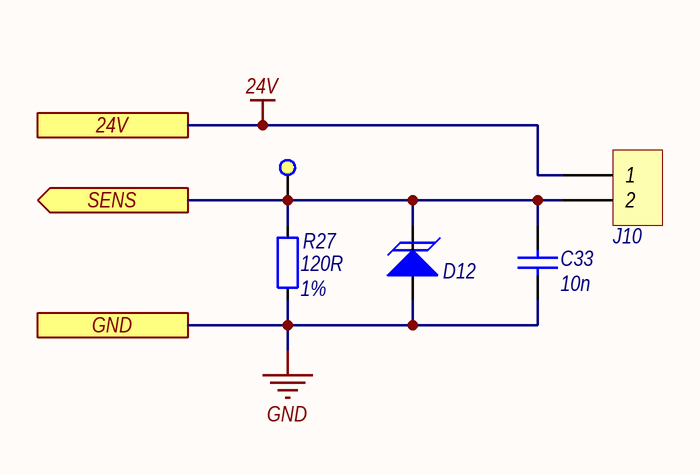
[diagram p18: gydrodrive_sensor.SchDoc]

### Parts
C33  Capacitance: 10n  [CAPC2012-0805M]  (hidden comment: CAP_0805)
D12  SMBJ3V3-E3/52  [SMB_M]  (value not drawn)
J10  DG142V-5.08-02P  [DG142V-5.08-02P]  (value not drawn)
R27  Resistance: 120R  Tolerance: 1%  [RESC2012-0805M]  (hidden comment: RES_0805)
TP9  Test point 1  [TP_1]  (value not drawn)  (no BOM)

### Ports
24V (see gydrodrive_sensors[3B], gydrodrive_button[2B], gydrodrive_control[2B], gydrodrive_currentSource[2B], gydrodrive_discreteControl[4B], gydrodrive_encoder[3B], gydrodrive_linearPosSensor[3B], gydrodrive_sensors[2B], gydrodrive_sto[3B], gydrodrive_supply[2C]), GND (see gydrodrive_sensors[3C], gydrodrive_button[2C], gydrodrive_can[3C], gydrodrive_control[2C], gydrodrive_currentSource[2B], gydrodrive_debugger[3C], gydrodrive_discreteControl[3B], gydrodrive_encoder[1B], gydrodrive_i2c[5C], gydrodrive_indication[3C], gydrodrive_inputTrim[2C], gydrodrive_interfaces[3A], gydrodrive_linearPosSensor[2C], gydrodrive_mcu[6D], gydrodrive_reservedPins[2C], gydrodrive_rs485[3B], gydrodrive_sensors[2B], gydrodrive_sto[2C], gydrodrive_supply[2C], gydrodrive_uart[4C]), SENS (out, see gydrodrive_sensors[3C])

### Nets
24V: J10.1 ; port 24V
GND: C33.1 D12.2(A) R27.1 ; port GND
SENS: C33.2 D12.1(K) J10.2 R27.2 TP9.1 ; port SENS

### Channels
S/SPR1: designators end in _1; ports 24V=24V GND=GND SENS=PRES_SENS1
S/SPR2: designators end in _2; ports 24V=24V GND=GND SENS=PRES_SENS2
S/SPR3: designators end in _3; ports 24V=24V GND=GND SENS=PRES_SENS3
S/SPR4: designators end in _4; ports 24V=24V GND=GND SENS=PRES_SENS4
S/SPR5: designators end in _5; ports 24V=24V GND=GND SENS=PRES_SENS5
S/SPT: designators end in _6; ports 24V=24V GND=GND SENS=TEMP_SENS

### Notes on the sheet
- Подп. и дата
- Инв. № дубл.
- Взам. инв. №
- Инв. № подл.
- Изм.
- Лист
- № докум.
- Подп.
- Дата
- Копировал
- Формат
- A4

### Library data of the parts
C33 = CAPC_0805: Конденсатор керамический, корпус 0805; Parameters: 10n,  50V; Voltage: 50V; Max Price: 5; Part Number: CAPC_0805; Part Name: ='Конд-р керам. 0805,  '  + Parameters; Component Type: Standart; Pin Count: 2
D12 = SMBJ3V3-E3/52: Защитный диод (TVS); Part Name: Защитный диод SMBJ3V3-E3/52; Parameters: 3V3, 600W; Voltage: 3V3; Max Price: 40; Part Number: SMBJ3V3-E3/52; Component Type: Standart; Pin Count: 0
J10 = DG142V-5.08-02P: Клеммник 2-контактный, шаг 5.08 мм; Part Name: Клеммник DG142V-5.08-02P; Parameters: 8А; Max Price: 60; System: Connector; Part Number: DG142V-5.08-02P; Component Type: Standart; Pin Count: 2
R27 = RESC_0805: Рез-р, корпус 0805; Parameters: 120R, 1%; Max Price: 3; Part Number: RESC_0805; Part Name: ='Рез-р 0805, ' + Parameters; Component Type: Standart
TP9 = Test point 1: Тестовый контакт круглый 1 мм; Part Number: Test point 1; Part Name: Тестовый контакт; Component Type: Standart (No BOM)

## Sheet gydrodrive_linearPosSensor.SchDoc
size 297 x 209 mm; SheetNumber: 20; SheetTotal: 22
Used 2 times, as channels S/L1, S/L2. Parts and nets are listed once, with the designators drawn on the sheet.
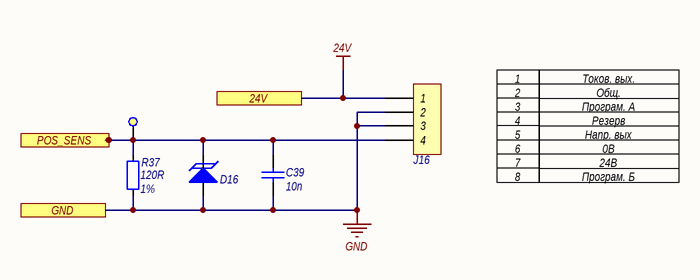
[diagram p19: gydrodrive_linearPosSensor.SchDoc]

### Parts
C39  Capacitance: 10n  [CAPC2012-0805M]  (hidden comment: CAP_0805)
D16  SMBJ3V3-E3/52  [SMB_M]  (value not drawn)
J16  DG142V-5.08-04P  [DG142V-5.08-04P]  (value not drawn)
R37  Resistance: 120R  Tolerance: 1%  [RESC2012-0805M]  (hidden comment: RES_0805)
TP18  Test point 1  [TP_1]  (value not drawn)  (no BOM)

### Ports
24V (see gydrodrive_sensors[3B], gydrodrive_button[2B], gydrodrive_control[2B], gydrodrive_currentSource[2B], gydrodrive_discreteControl[4B], gydrodrive_encoder[3B], gydrodrive_sensor[2B], gydrodrive_sensors[2B], gydrodrive_sto[3B], gydrodrive_supply[2C]), GND (see gydrodrive_sensors[3B], gydrodrive_button[2C], gydrodrive_can[3C], gydrodrive_control[2C], gydrodrive_currentSource[2B], gydrodrive_debugger[3C], gydrodrive_discreteControl[3B], gydrodrive_encoder[1B], gydrodrive_i2c[5C], gydrodrive_indication[3C], gydrodrive_inputTrim[2C], gydrodrive_interfaces[3A], gydrodrive_mcu[6D], gydrodrive_reservedPins[2C], gydrodrive_rs485[3B], gydrodrive_sensor[2C], gydrodrive_sensors[2B], gydrodrive_sto[2C], gydrodrive_supply[2C], gydrodrive_uart[4C]), POS_SENS (out, see gydrodrive_sensors[3B])

### Nets
24V: J16.1 ; port 24V
GND: C39.1 D16.2(A) J16.2 J16.3 R37.1 ; port GND
POS_SENS: C39.2 D16.1(K) J16.4 R37.2 TP18.1 ; port POS_SENS

### Channels
S/L1: designators end in _1; ports 24V=24V GND=GND POS_SENS=POS_SENS1
S/L2: designators end in _2; ports 24V=24V GND=GND POS_SENS=POS_SENS2

### Notes on the sheet
- 1
- 2
- 3
- Токов. вых.
- Програм. А
- Общ.
- 4
- 5
- 6
- 7
- 8
- Програм. Б
- Напр. вых
- Резерв
- 0В
- 24В
- Подп. и дата
- Инв. № дубл.
- Взам. инв. №
- Инв. № подл.
- Изм.
- Лист
- № докум.
- Подп.
- Дата
- Копировал
- Формат
- A4

### Library data of the parts
C39 = CAPC_0805: as C33 on sheet gydrodrive_sensor; Part Number: CAPC_0805; Part Name: ='Конд-р керам. 0805,  '  + Parameters; Component Type: Standart; Pin Count: 2
D16 = SMBJ3V3-E3/52: as D12 on sheet gydrodrive_sensor; Part Number: SMBJ3V3-E3/52; Component Type: Standart; Pin Count: 0
J16 = DG142V-5.08-04P: Клеммник 4-контактный, шаг 5.08 мм; Part Name: Клеммник DG142V-5.08-04P; Parameters: 8А; Max Price: 60; System: Connector; Part Number: DG142V-5.08-04P; Component Type: Standart; Pin Count: 4
R37 = RESC_0805: as R27 on sheet gydrodrive_sensor; Part Number: RESC_0805; Part Name: ='Рез-р 0805, ' + Parameters; Component Type: Standart
TP18 = Test point 1: Тестовый контакт круглый 1 мм; Part Number: Test point 1; Part Name: Тестовый контакт; Component Type: Standart (No BOM)

## Sheet gydrodrive_reservedPins.SchDoc
size 297 x 209 mm; SheetNumber: 21; SheetTotal: 22
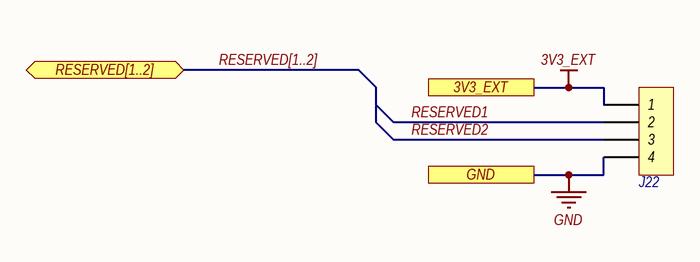
[diagram p20: gydrodrive_reservedPins.SchDoc]

### Parts
J22  DG142V-5.08-04P  [DG142V-5.08-04P]  (value not drawn)

### Ports
3V3_EXT (see gydrodrive_main[4C], gydrodrive_i2c[5B], gydrodrive_interfaces[3A], gydrodrive_supply[5B], gydrodrive_uart[4B]), GND (see gydrodrive_main[4C], gydrodrive_button[3C], gydrodrive_can[3C], gydrodrive_control[3B], gydrodrive_currentSource[2B], gydrodrive_debugger[4C], gydrodrive_discreteControl[3B], gydrodrive_encoder[1B], gydrodrive_i2c[5C], gydrodrive_indication[4C], gydrodrive_inputTrim[4C], gydrodrive_interfaces[3A], gydrodrive_linearPosSensor[2C], gydrodrive_mcu[6D], gydrodrive_rs485[3B], gydrodrive_sensor[3C], gydrodrive_sensors[2B], gydrodrive_sto[3C], gydrodrive_supply[2C], gydrodrive_uart[4C]), RESERVED[1..2] (bidir, see gydrodrive_main[3C], gydrodrive_mcu[1A])

### Nets
3V3_EXT: J22.1 ; port 3V3_EXT
GND: J22.4 ; port GND
RESERVED1: J22.2
RESERVED2: J22.3

### Buses and harness runs
bus RESERVED[1..2] = port RESERVED[1..2]

### Notes on the sheet
- Подп. и дата
- Инв. № дубл.
- Взам. инв. №
- Инв. № подл.
- Изм.
- Лист
- № докум.
- Подп.
- Дата
- Копировал
- Формат
- A4

### Library data of the parts
J22 = DG142V-5.08-04P: as J16 on sheet gydrodrive_linearPosSensor; Part Number: DG142V-5.08-04P; Component Type: Standart; Pin Count: 4

## Sheet gydrodrive_encoder.SchDoc
size 297 x 209 mm; SheetNumber: 22; SheetTotal: 22
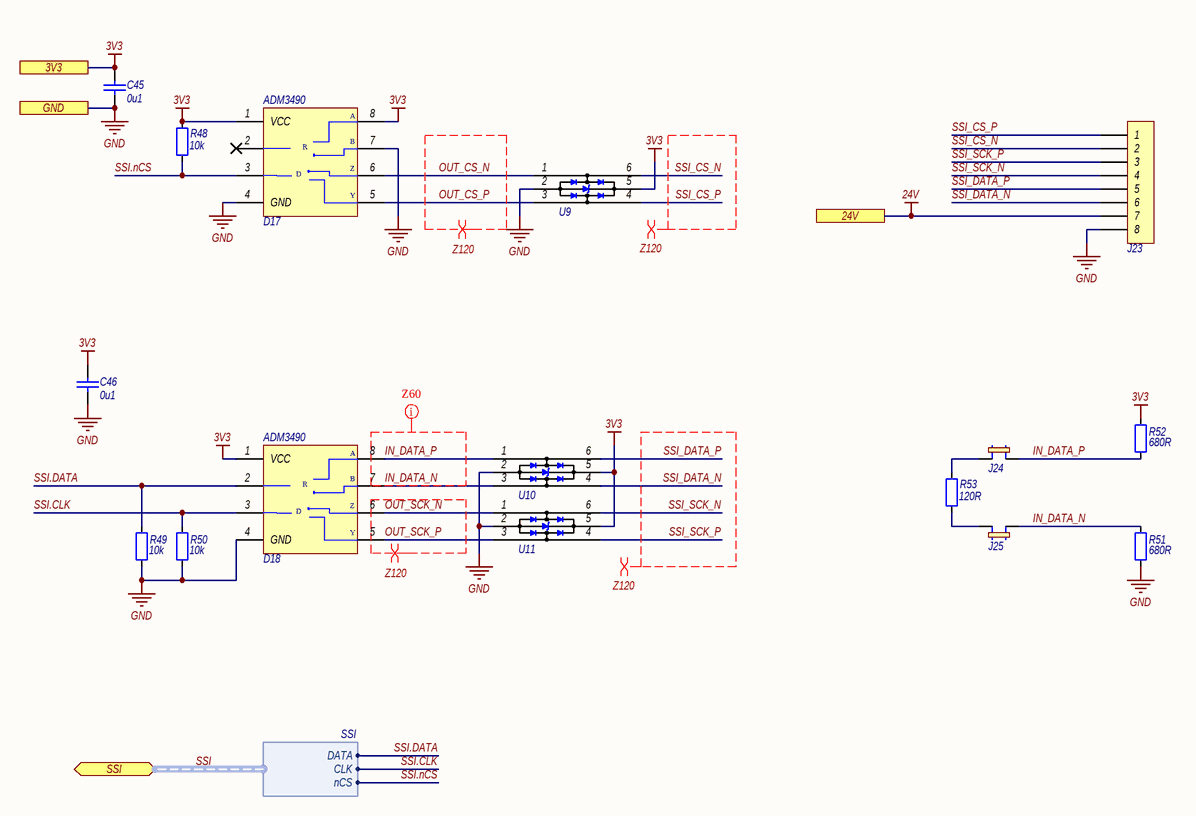
[diagram p21: gydrodrive_encoder.SchDoc]

### Parts
C45  Capacitance: 0u1  [CAPC2012-0805M]  (hidden comment: CAP_0805)
C46  Capacitance: 0u1  [CAPC2012-0805M]  (hidden comment: CAP_0805)
D17  ADM3490  [SO8_M]
D18  ADM3490  [SO8_M]
J23  DG142V-5.08-08P  [DG142V-5.08-08P]  (value not drawn)
J24  PLS-2.54-2 JUMP  [PLS-2-2.54]  (value not drawn)
J25  PLS-2.54-2 JUMP  [PLS-2-2.54]  (value not drawn)
R48  Resistance: 10k  [RESC2012-0805M]  (hidden comment: RES_0805)
R49  Resistance: 10k  [RESC2012-0805M]  (hidden comment: RES_0805)
R50  Resistance: 10k  [RESC2012-0805M]  (hidden comment: RES_0805)
R51  Resistance: 680R  [RESC3216-1206M]  (hidden comment: RES_1206)
R52  Resistance: 680R  [RESC3216-1206M]  (hidden comment: RES_1206)
R53  Resistance: 120R  [RESC3216-1206M]  (hidden comment: RES_1206)
U9  USBLC6-2SC6  [SOT23-6AM]  (value not drawn)
U10  USBLC6-2SC6  [SOT23-6AM]  (value not drawn)
U11  USBLC6-2SC6  [SOT23-6AM]  (value not drawn)

### Ports
3V3 (see gydrodrive_main[4D], gydrodrive_button[3B], gydrodrive_can[3B], gydrodrive_debugger[3B], gydrodrive_indication[4C], gydrodrive_inputTrim[4B], gydrodrive_interfaces[3C], gydrodrive_mcu[4C], gydrodrive_rs485[4B], gydrodrive_sto[3B], gydrodrive_supply[5B]), 24V (see gydrodrive_main[4C], gydrodrive_button[4B], gydrodrive_control[4B], gydrodrive_currentSource[2B], gydrodrive_discreteControl[4B], gydrodrive_linearPosSensor[3B], gydrodrive_sensor[3B], gydrodrive_sensors[2B], gydrodrive_sto[4B], gydrodrive_supply[2B]), GND (see gydrodrive_main[4D], gydrodrive_button[3C], gydrodrive_can[3C], gydrodrive_control[3B], gydrodrive_currentSource[2B], gydrodrive_debugger[4C], gydrodrive_discreteControl[3B], gydrodrive_i2c[5C], gydrodrive_indication[4C], gydrodrive_inputTrim[4C], gydrodrive_interfaces[3A], gydrodrive_linearPosSensor[2C], gydrodrive_mcu[6D], gydrodrive_reservedPins[4B], gydrodrive_rs485[3B], gydrodrive_sensor[3C], gydrodrive_sensors[2B], gydrodrive_sto[3C], gydrodrive_supply[2C], gydrodrive_uart[4C]), SSI (bidir, harness SSI, see gydrodrive_main[3D], gydrodrive_mcu[1D])

### Harnesses
SSI: DATA, CLK, nCS

### Nets
3V3: C45.2 C46.2 D17.1(VCC) D17.8(A) D18.1(VCC) R48.2 R52.2 U9.5(Vbus) U10.5(Vbus) U11.5(Vbus) ; port 3V3
24V: J23.7 ; port 24V
GND: C45.1 C46.1 D17.4(GND) D17.7(B) D18.4(GND) J23.8 R49.1 R50.1 R51.2 U9.2(GND) U10.2(GND) U11.2(GND) ; port GND
IN_DATA_N: D18.7(B) J25.1 R51.1 U10.3(IO2)
IN_DATA_P: D18.8(A) J24.1 R52.1 U10.1(IO1)
OUT_CS_N: D17.6(Z) U9.1(IO1)
OUT_CS_P: D17.5(Y) U9.3(IO2)
OUT_SCK_N: D18.6(Z) U11.1(IO1)
OUT_SCK_P: D18.5(Y) U11.3(IO2)
SSI.CLK: D18.3(DI) R50.2 ; port SSI.CLK
SSI.DATA: D18.2 R49.2 ; port SSI.DATA
SSI.nCS: D17.3(DI) R48.1 ; port SSI.nCS
SSI_CS_N: J23.2 U9.6(IO1)
SSI_CS_P: J23.1 U9.4(IO2)
SSI_DATA_N: J23.6 U10.4(IO2)
SSI_DATA_P: J23.5 U10.6(IO1)
SSI_SCK_N: J23.4 U11.6(IO1)
SSI_SCK_P: J23.3 U11.4(IO2)
NetJ24_2: J24.2 R53.2
NetJ25_2: J25.2 R53.1

Not connected (* = marked no-connect by the designer): D17 2*

### Buses and harness runs
harness SSI = port SSI

### Layout directives
differential pair; differential pair class Z120: OUT_CS_N, OUT_CS_P, OUT_SCK_N, OUT_SCK_P, SSI_CS_N, SSI_CS_P, SSI_DATA_N, SSI_DATA_P, SSI_SCK_N, SSI_SCK_P
net class Z60: IN_DATA_N, IN_DATA_P

### Notes on the sheet
- Подп. и дата
- Инв. № дубл.
- Взам. инв. №
- Инв. № подл.
- Изм.
- Лист
- № докум.
- Подп.
- Дата
- Копировал
- Формат
- A4
- (in symbol ADM3490) R; D

### Library data of the parts
C45 C46 = CAPC_0805: as C34 on sheet gydrodrive_rs485; Part Number: CAPC_0805; Part Name: ='Конд-р керам. 0805,  '  + Parameters; Component Type: Standart; Pin Count: 2
D17 D18 = ADM3490: Дифференциальный приемопередатчик rs422; Part Name: Микросхема ADM3490; Parameters: 3V3; Max Price: 300; Part Number: ADM3490; Component Type: Standart
J23 = DG142V-5.08-08P: Клеммник 8-контактный, шаг 5.08 мм; Part Name: Клеммник DG142V-5.08-08P; Parameters: 8А; Max Price: 60; System: Connector; Part Number: DG142V-5.08-08P; Component Type: Standart; Pin Count: 8
J24 J25 = PLS-2.54-2 JUMP: as J18 on sheet gydrodrive_rs485; Part Number: PLS-2.54-2 JUMP; Component Type: Standart; Pin Count: 2
R48-R50 = RESC_0805: as R33 on sheet gydrodrive_can; Part Number: RESC_0805; Part Name: ='Рез-р 0805, ' + Parameters; Component Type: Standart
R51 R52 = RESC_1206: as R28 on sheet gydrodrive_rs485; Part Number: RESC_1206; Part Name: ='Рез-р 1206, ' + Parameters; Component Type: Standart
R53 = RESC_1206: as R29 on sheet gydrodrive_rs485; Part Number: RESC_1206; Part Name: ='Рез-р 1206, ' + Parameters; Component Type: Standart
U9-U11 = USBLC6-2SC6: as U6 on sheet gydrodrive_rs485; Part Number: USBLC6-2SC6; Component Type: Standart; Pin Count: 6; Voltage: 5.25V

## Nets that join several sheets
3V3: gydrodrive_mcu (18 pins), gydrodrive_supply (6 pins), gydrodrive_debugger (J7.2 R17.2 R18.2 R19.2), B1 (R7_1.2), B2 (R7_2.2), B3 (R7_3.2), B4 (R7_4.2), B5 (R7_5.2), B6 (R7_6.2), gydrodrive_inputTrim (J2.1), gydrodrive_indication (R20.1 R22.1), gydrodrive_sto (R35.2), gydrodrive_rs485 (7 pins), gydrodrive_can (C37.2 D14.5 R58.2 R59.2), gydrodrive_encoder (10 pins)
3V3_EXT: gydrodrive_supply (6 pins), gydrodrive_i2c (6 pins), gydrodrive_uart (J12.1), gydrodrive_reservedPins (J22.1)
5V: gydrodrive_supply (8 pins), gydrodrive_discreteControl (C22.2 D6.6), gydrodrive_currentSource (C41.2 C42.2 OA1.8), gydrodrive_can (C36.2 D14.3 U7.5)
24V: gydrodrive_supply (6 pins), B1 (R8_1.2), B2 (R8_2.2), B3 (R8_3.2), B4 (R8_4.2), B5 (R8_5.2), B6 (R8_6.2), C1 (C30_1.2 C31_1.1 D10_1.13 J9_1.5), C2 (C30_2.2 C31_2.1 D10_2.13 J9_2.5), gydrodrive_discreteControl (8 pins), gydrodrive_sto (R36.2), gydrodrive_currentSource (C28.1 C29.1 R38.2 U5.1), S/SPR1 (J10_1.1), S/SPR2 (J10_2.1), S/SPR3 (J10_3.1), S/SPR4 (J10_4.1), S/SPR5 (J10_5.1), S/L1 (J16_1.1), S/L2 (J16_2.1), S/SPT (J10_6.1), gydrodrive_encoder (J23.7)
GND: gydrodrive_mcu (21 pins), gydrodrive_supply (21 pins), gydrodrive_debugger (J8.3 J8.4), B1 (BUT1_1.3 BUT1_1.4 D3_1.3 J3_1.2), B2 (BUT1_2.3 BUT1_2.4 D3_2.3 J3_2.2), B3 (BUT1_3.3 BUT1_3.4 D3_3.3 J3_3.2), B4 (BUT1_4.3 BUT1_4.4 D3_4.3 J3_4.2), B5 (BUT1_5.3 BUT1_5.4 D3_5.3 J3_5.2), B6 (BUT1_6.3 BUT1_6.4 D3_6.3 J3_6.2), gydrodrive_inputTrim (J2.3), C1 (11 pins), C2 (11 pins), gydrodrive_indication (VT3.2 VT4.2), gydrodrive_discreteControl (14 pins), gydrodrive_sto (D15.3 J15.2), gydrodrive_currentSource (14 pins), gydrodrive_i2c (C47.2 D19.4 J14.4 U12.2), gydrodrive_uart (J12.4), gydrodrive_rs485 (9 pins), gydrodrive_can (7 pins), S/SPR1 (C33_1.1 D12_1.2 R27_1.1), S/SPR2 (C33_2.1 D12_2.2 R27_2.1), S/SPR3 (C33_3.1 D12_3.2 R27_3.1), S/SPR4 (C33_4.1 D12_4.2 R27_4.1), S/SPR5 (C33_5.1 D12_5.2 R27_5.1), S/L1 (5 pins), S/L2 (5 pins), S/SPT (C33_6.1 D12_6.2 R27_6.1), gydrodrive_reservedPins (J22.4), gydrodrive_encoder (12 pins)
BUT1: gydrodrive_mcu (U1.56), B1 (D3_1.4 R7_1.1)
BUT2: gydrodrive_mcu (U1.57), B2 (D3_2.4 R7_2.1)
BUT3: gydrodrive_mcu (U1.58), B3 (D3_3.4 R7_3.1)
BUT4: gydrodrive_mcu (U1.60), B4 (D3_4.4 R7_4.1)
BUT5: gydrodrive_mcu (U1.62), B5 (D3_5.4 R7_5.1)
BUT6: gydrodrive_mcu (U1.2), B6 (D3_6.4 R7_6.1)
CAN.RX: gydrodrive_mcu (U1.45), gydrodrive_can (D14.4 R58.1 TP15.1)
CAN.TX: gydrodrive_mcu (U1.46), gydrodrive_can (D14.1 R59.1 TP14.1)
CS_CTRL: gydrodrive_mcu (U1.20), gydrodrive_currentSource (R39.1)
CS_ON: gydrodrive_mcu (U1.37), gydrodrive_currentSource (R40.2)
GD_CTRL1: gydrodrive_mcu (U1.19), C1 (D10_1.3)
GD_CTRL2: gydrodrive_mcu (U1.18), C2 (D10_2.3)
GD_FB1: gydrodrive_mcu (U1.22), C1 (5 pins)
GD_FB2: gydrodrive_mcu (U1.21), C2 (5 pins)
I2C.SCL: gydrodrive_mcu (R62.2 U1.40), gydrodrive_i2c (D19.6 R67.1 TP17.1)
I2C.SDA: gydrodrive_mcu (R63.2 U1.41), gydrodrive_i2c (D19.3 R66.1 TP16.1)
POS_SENS1: gydrodrive_mcu (U1.17), S/L1 (5 pins)
POS_SENS2: gydrodrive_mcu (U1.14), S/L2 (5 pins)
PRES_SENS1: gydrodrive_mcu (U1.13), S/SPR1 (5 pins)
PRES_SENS2: gydrodrive_mcu (U1.11), S/SPR2 (5 pins)
PRES_SENS3: gydrodrive_mcu (U1.9), S/SPR3 (5 pins)
PRES_SENS4: gydrodrive_mcu (U1.12), S/SPR4 (5 pins)
PRES_SENS5: gydrodrive_mcu (U1.10), S/SPR5 (5 pins)
RESERVED1: gydrodrive_mcu (U1.39), gydrodrive_reservedPins (J22.2)
RESERVED2: gydrodrive_mcu (U1.38), gydrodrive_reservedPins (J22.3)
RS485.RX: gydrodrive_mcu (U1.55), gydrodrive_rs485 (D13.1 R55.2 TP10.1)
RS485.TX: gydrodrive_mcu (U1.54), gydrodrive_rs485 (D13.4 R54.2 R56.2 TP1.1)
SSI.CLK: gydrodrive_mcu (U1.35), gydrodrive_encoder (D18.3 R50.2)
SSI.DATA: gydrodrive_mcu (U1.36), gydrodrive_encoder (D18.2 R49.2)
SSI.nCS: gydrodrive_mcu (U1.34), gydrodrive_encoder (D17.3 R48.1)
STO: gydrodrive_mcu (U1.4), gydrodrive_sto (D15.4 R35.1)
SWD.RST: gydrodrive_mcu (C1.2 U1.7), gydrodrive_debugger (J8.2 R19.1)
SWD.SWCLK: gydrodrive_mcu (U1.50), gydrodrive_debugger (J8.5 R18.1)
SWD.SWDIO: gydrodrive_mcu (U1.49), gydrodrive_debugger (J8.1 R17.1)
TEMP_SENS: gydrodrive_mcu (U1.8), S/SPT (5 pins)
TRIM_RES: gydrodrive_mcu (U1.33), gydrodrive_inputTrim (J2.2 TP5.1)
UART.RX: gydrodrive_mcu (R61.1 U1.44), gydrodrive_uart (J12.2 TP12.1)
UART.TX: gydrodrive_mcu (R60.1 U1.43), gydrodrive_uart (J12.3 TP13.1)

## Assembly variants
Standart: not fitted C35 C38 J3_1 J3_2 J3_3 J3_4 J3_5 J3_6 R4 R42 R66 R67